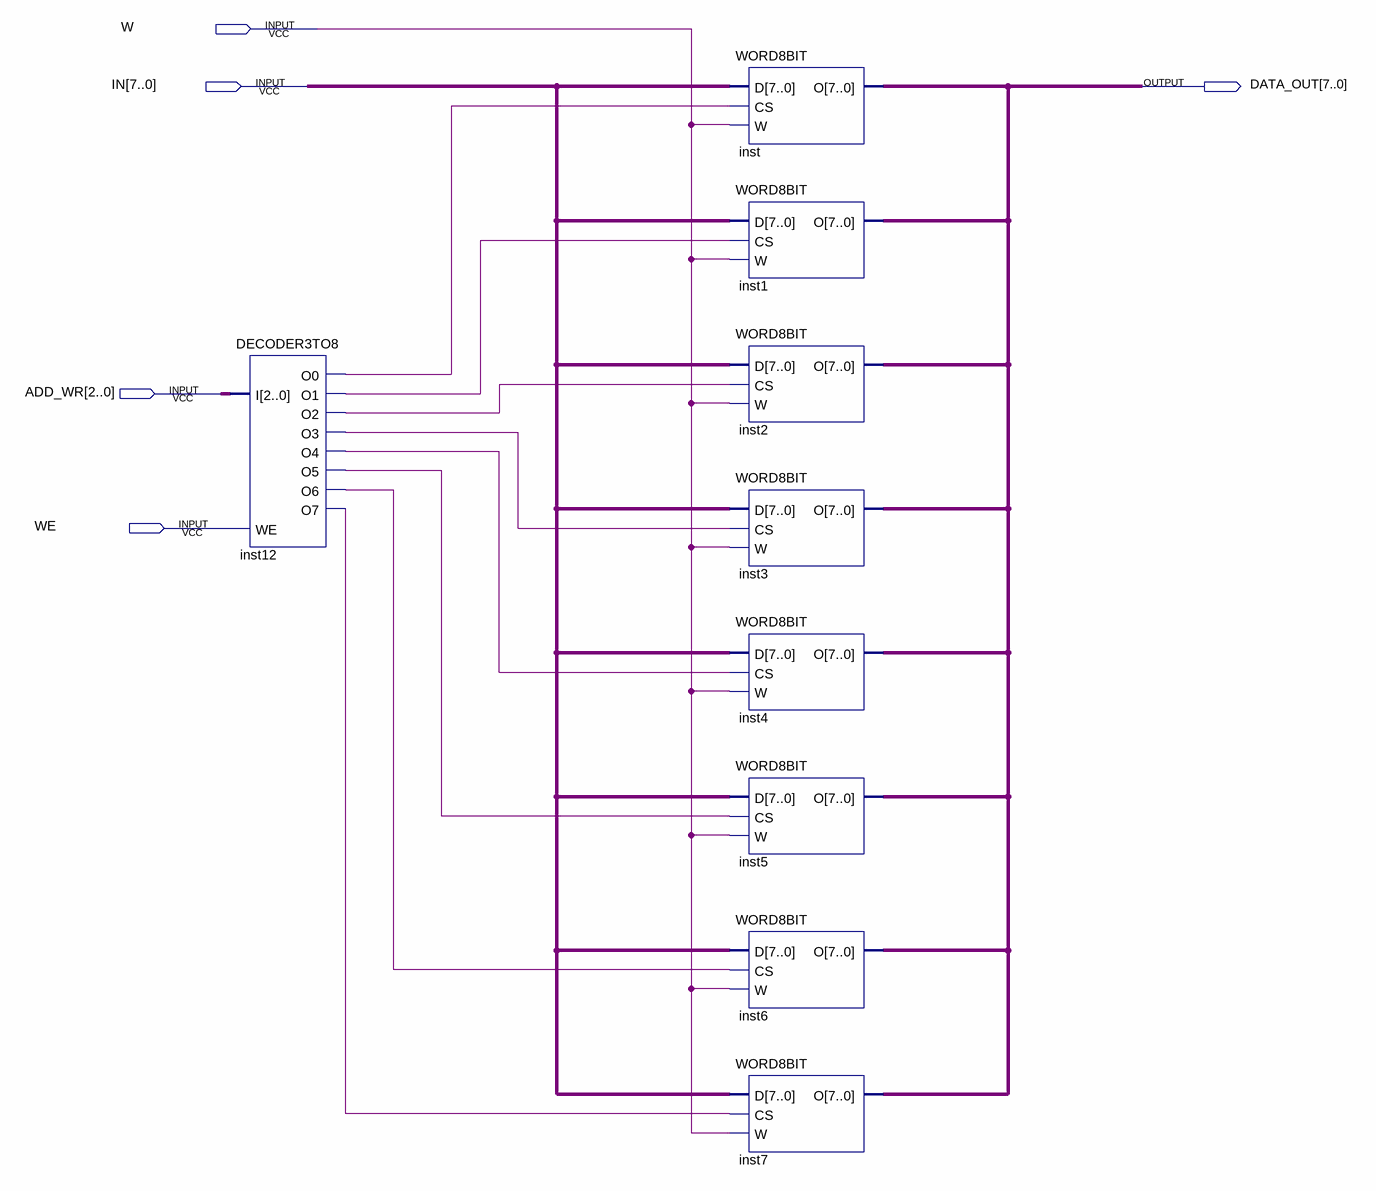
[diagram p0: schematic sheet]
// Quartus schematic RAM8W8BIT.bdf as structural Verilog: 9 symbols, 5 pins
module RAM8W8BIT (
  input  W,
  input  [7:0] IN,
  input  [2:0] ADD_WR,
  input  WE,
  output [7:0] DATA_OUT
);

  wire inst12_o0, inst12_o1, inst12_o2, inst12_o3, inst12_o4, inst12_o5, inst12_o6, inst12_o7;

  DECODER3TO8 inst12 (
    .WE(WE), .I(ADD_WR), .O0(inst12_o0), .O1(inst12_o1), .O2(inst12_o2), .O3(inst12_o3), .O4(inst12_o4),
    .O5(inst12_o5), .O6(inst12_o6), .O7(inst12_o7));
  WORD8BIT inst (.D(IN), .CS(inst12_o0), .W(W), .O(DATA_OUT));
  WORD8BIT inst1 (.D(IN), .CS(inst12_o1), .W(W), .O(DATA_OUT));
  WORD8BIT inst2 (.D(IN), .CS(inst12_o2), .W(W), .O(DATA_OUT));
  WORD8BIT inst3 (.D(IN), .CS(inst12_o3), .W(W), .O(DATA_OUT));
  WORD8BIT inst4 (.D(IN), .CS(inst12_o4), .W(W), .O(DATA_OUT));
  WORD8BIT inst5 (.D(IN), .CS(inst12_o5), .W(W), .O(DATA_OUT));
  WORD8BIT inst6 (.D(IN), .CS(inst12_o6), .W(W), .O(DATA_OUT));
  WORD8BIT inst7 (.D(IN), .CS(inst12_o7), .W(W), .O(DATA_OUT));
endmodule
